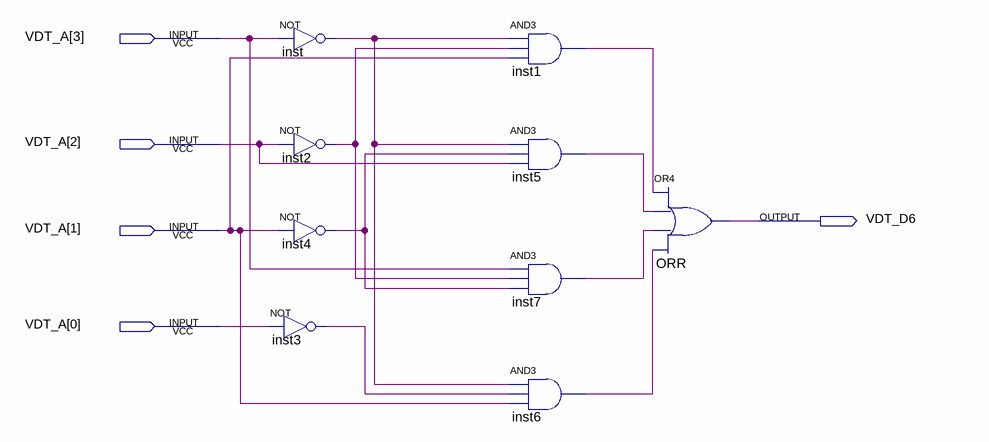
[diagram p0: schematic sheet]
// Quartus schematic D6.bdf as structural Verilog: 9 symbols, 5 pins
module D6 (
  input  [3:0] VDT_A,
  output VDT_D6
);

  wire inst1_out, inst2_out, inst3_out, inst4_out, inst5_out, inst6_out, inst7_out, inst_out;

  not inst (inst_out, VDT_A[3]);
  not inst2 (inst2_out, VDT_A[2]);
  not inst4 (inst4_out, VDT_A[1]);
  not inst3 (inst3_out, VDT_A[0]);
  and inst1 (inst1_out, inst_out, inst2_out, VDT_A[1]);
  and inst5 (inst5_out, inst_out, inst4_out, VDT_A[2]);
  and inst7 (inst7_out, VDT_A[3], inst2_out, inst4_out);
  and inst6 (inst6_out, inst_out, inst3_out, VDT_A[1]);
  or ORR (VDT_D6, inst1_out, inst5_out, inst7_out, inst6_out);
endmodule
